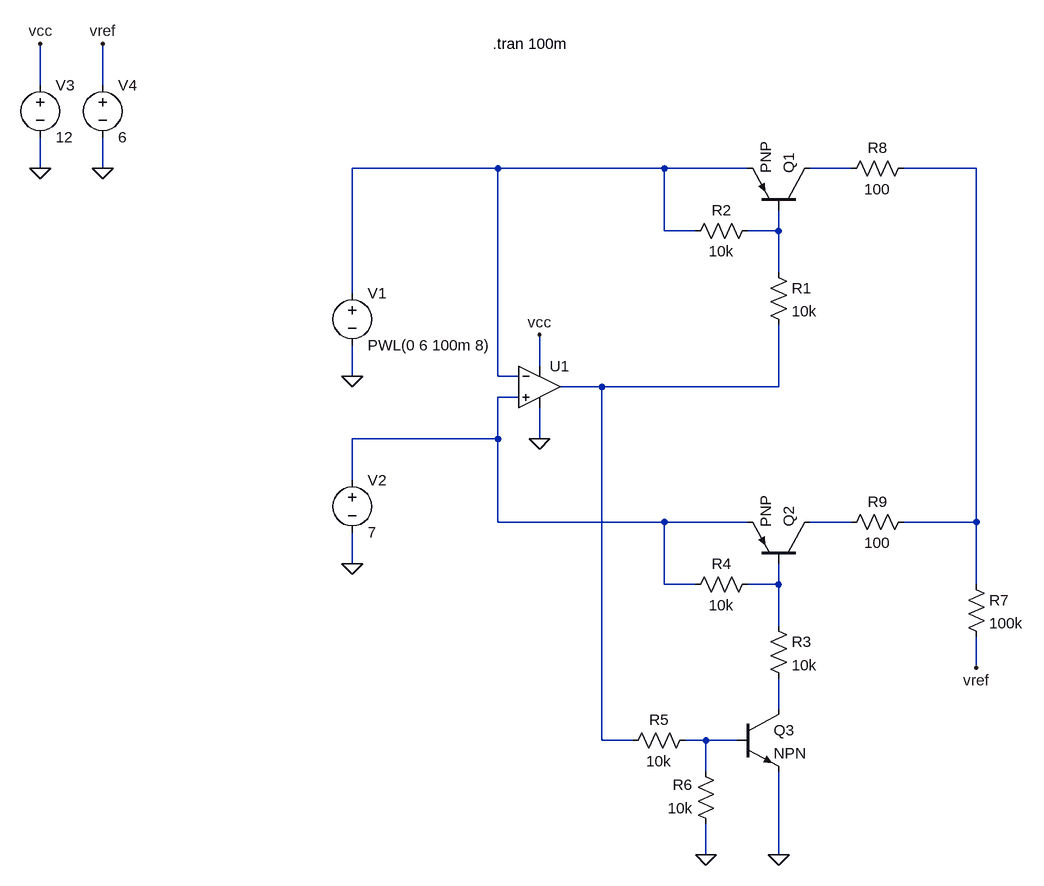
[diagram p0: schematic max_01.asc]
max_01.asc, the LTspice schematic file:
Version 4
SHEET 1 880 1012
WIRE -864 -192 -864 -256
WIRE -768 -192 -768 -256
WIRE -864 -64 -864 -112
WIRE -768 -64 -768 -112
WIRE -160 -64 -384 -64
WIRE 96 -64 -160 -64
WIRE 224 -64 96 -64
WIRE 384 -64 320 -64
WIRE 576 -64 464 -64
WIRE 96 32 96 -64
WIRE 144 32 96 32
WIRE 272 32 272 0
WIRE 272 32 224 32
WIRE 272 96 272 32
WIRE -384 128 -384 -64
WIRE -96 240 -96 192
WIRE -384 256 -384 208
WIRE -160 256 -160 -64
WIRE -128 256 -160 256
WIRE 0 272 -64 272
WIRE 272 272 272 176
WIRE 272 272 0 272
WIRE -128 288 -160 288
WIRE -160 352 -160 288
WIRE -160 352 -384 352
WIRE -96 352 -96 304
WIRE -384 416 -384 352
WIRE -160 480 -160 352
WIRE 96 480 -160 480
WIRE 224 480 96 480
WIRE 384 480 320 480
WIRE 576 480 576 -64
WIRE 576 480 464 480
WIRE -384 544 -384 496
WIRE 96 576 96 480
WIRE 144 576 96 576
WIRE 272 576 272 544
WIRE 272 576 224 576
WIRE 576 576 576 480
WIRE 272 640 272 576
WIRE 576 704 576 656
WIRE 272 768 272 720
WIRE 0 816 0 272
WIRE 48 816 0 816
WIRE 160 816 128 816
WIRE 208 816 160 816
WIRE 160 864 160 816
WIRE 160 992 160 944
WIRE 272 992 272 864
FLAG -384 544 0
FLAG -384 256 0
FLAG -864 -64 0
FLAG -864 -256 vcc
FLAG -96 352 0
FLAG -96 192 vcc
FLAG 272 992 0
FLAG 160 992 0
FLAG -768 -64 0
FLAG -768 -256 vref
FLAG 576 704 vref
SYMBOL voltage -384 112 R0
WINDOW 123 0 0 Left 2
WINDOW 39 0 0 Left 2
SYMATTR InstName V1
SYMATTR Value PWL(0 6 100m 8)
SYMBOL voltage -384 400 R0
WINDOW 123 0 0 Left 2
WINDOW 39 0 0 Left 2
SYMATTR InstName V2
SYMATTR Value 7
SYMBOL Opamps\\UniversalOpamp2 -96 272 R0
SYMATTR InstName U1
SYMBOL voltage -864 -208 R0
SYMATTR InstName V3
SYMATTR Value 12
SYMBOL pnp 320 0 M270
SYMATTR InstName Q1
SYMBOL pnp 320 544 M270
SYMATTR InstName Q2
SYMBOL res 256 80 R0
SYMATTR InstName R1
SYMATTR Value 10k
SYMBOL res 240 16 R90
WINDOW 0 0 56 VBottom 2
WINDOW 3 32 56 VTop 2
SYMATTR InstName R2
SYMATTR Value 10k
SYMBOL npn 208 768 R0
SYMATTR InstName Q3
SYMBOL res 256 624 R0
SYMATTR InstName R3
SYMATTR Value 10k
SYMBOL res 240 560 R90
WINDOW 0 0 56 VBottom 2
WINDOW 3 32 56 VTop 2
SYMATTR InstName R4
SYMATTR Value 10k
SYMBOL res 144 800 R90
WINDOW 0 0 56 VBottom 2
WINDOW 3 32 56 VTop 2
SYMATTR InstName R5
SYMATTR Value 10k
SYMBOL res 176 960 R180
WINDOW 0 36 76 Left 2
WINDOW 3 36 40 Left 2
SYMATTR InstName R6
SYMATTR Value 10k
SYMBOL res 560 560 R0
SYMATTR InstName R7
SYMATTR Value 100k
SYMBOL res 480 -80 R90
WINDOW 0 0 56 VBottom 2
WINDOW 3 32 56 VTop 2
SYMATTR InstName R8
SYMATTR Value 100
SYMBOL res 480 464 R90
WINDOW 0 0 56 VBottom 2
WINDOW 3 32 56 VTop 2
SYMATTR InstName R9
SYMATTR Value 100
SYMBOL voltage -768 -208 R0
SYMATTR InstName V4
SYMATTR Value 6
TEXT -168 -256 Left 2 !.tran 100m

The netlist it stands for:
* max_01.asc
V1 N001 0 PWL(0 6 100m 8)
V2 N006 0 7
XU1 N006 N001 vcc 0 N005 level.2 Avol=1Meg GBW=10Meg Slew=10Meg ilimit=25m rail=0 Vos=0 phimargin=45 en=0 enk=0 in=0 ink=0 Rin=500Meg  ; pins IN+ IN- V+ V- OUT
V3 vcc 0 12
Q1 N002 N004 N001 0 PNP
Q2 N007 N008 N006 0 PNP
R1 N004 N005 10k
R2 N004 N001 10k
Q3 N009 N010 0 0 NPN
R3 N008 N009 10k
R4 N008 N006 10k
R5 N010 N005 10k
R6 0 N010 10k
R7 N003 vref 100k
R8 N003 N002 100
R9 N003 N007 100
V4 vref 0 6
.model NPN NPN
.model PNP PNP
.lib standard.bjt
.tran 100m
.lib UniversalOpamps2.sub
.backanno
.end